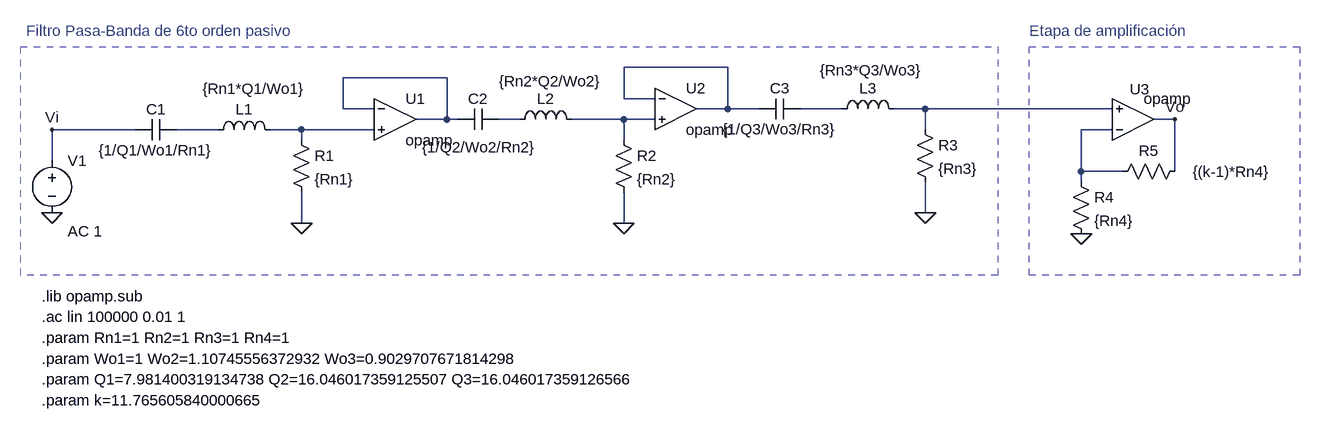
[diagram p0: schematic simulación circuital red pasiva 2.asc]
simulación circuital red pasiva 2.asc, the LTspice schematic file:
Version 4
SHEET 1 1604 680
WIRE 720 64 560 64
WIRE 288 80 128 80
WIRE 560 112 560 64
WIRE 608 112 560 112
WIRE 128 128 128 80
WIRE 176 128 128 128
WIRE 720 128 720 64
WIRE 720 128 672 128
WIRE 768 128 720 128
WIRE 896 128 832 128
WIRE 1024 128 976 128
WIRE 1312 128 1024 128
WIRE 288 144 288 80
WIRE 288 144 240 144
WIRE 304 144 288 144
WIRE 400 144 368 144
WIRE 560 144 480 144
WIRE 608 144 560 144
WIRE 1408 144 1376 144
WIRE -192 160 -320 160
WIRE -64 160 -128 160
WIRE 64 160 16 160
WIRE 176 160 64 160
WIRE 1024 160 1024 128
WIRE 1312 160 1264 160
WIRE 64 176 64 160
WIRE 560 176 560 144
WIRE -320 208 -320 160
WIRE 1264 224 1264 160
WIRE 1328 224 1264 224
WIRE 1408 224 1408 144
WIRE 1264 240 1264 224
WIRE 1024 288 1024 240
WIRE 64 304 64 256
WIRE 560 304 560 256
FLAG -320 288 0
FLAG 560 304 0
FLAG 1024 288 0
FLAG -320 160 Vi
FLAG 1264 320 0
FLAG 1408 144 Vo
FLAG 64 304 0
SYMBOL OpAmps\\opamp 208 80 R0
SYMATTR InstName U1
SYMBOL OpAmps\\opamp 640 64 R0
SYMATTR InstName U2
SYMBOL res 48 160 R0
SYMATTR InstName R1
SYMATTR Value {Rn1}
SYMBOL cap -128 144 R90
WINDOW 0 0 32 VBottom 2
WINDOW 3 32 32 VTop 2
SYMATTR InstName C1
SYMATTR Value {1/Q1/Wo1/Rn1}
SYMBOL ind -80 176 R270
WINDOW 0 32 56 VTop 2
WINDOW 3 95 71 VBottom 2
SYMATTR InstName L1
SYMATTR Value {Rn1*Q1/Wo1}
SYMBOL voltage -320 192 R0
WINDOW 123 24 124 Left 2
WINDOW 39 0 0 Left 0
SYMATTR Value2 AC 1
SYMATTR InstName V1
SYMATTR Value ""
SYMBOL res 544 160 R0
SYMATTR InstName R2
SYMATTR Value {Rn2}
SYMBOL cap 368 128 R90
WINDOW 0 0 32 VBottom 2
WINDOW 3 43 30 VTop 2
SYMATTR InstName C2
SYMATTR Value {1/Q2/Wo2/Rn2}
SYMBOL ind 384 160 R270
WINDOW 0 32 56 VTop 2
WINDOW 3 90 63 VBottom 2
SYMATTR InstName L2
SYMATTR Value {Rn2*Q2/Wo2}
SYMBOL res 1008 144 R0
SYMATTR InstName R3
SYMATTR Value {Rn3}
SYMBOL cap 832 112 R90
WINDOW 0 0 32 VBottom 2
WINDOW 3 32 32 VTop 2
SYMATTR InstName C3
SYMATTR Value {1/Q3/Wo3/Rn3}
SYMBOL ind 880 144 R270
WINDOW 0 32 56 VTop 2
WINDOW 3 91 61 VBottom 2
SYMATTR InstName L3
SYMATTR Value {Rn3*Q3/Wo3}
SYMBOL OpAmps\\opamp 1344 208 M180
WINDOW 0 -5 110 Left 2
SYMATTR InstName U3
SYMBOL res 1248 224 R0
SYMATTR InstName R4
SYMATTR Value {Rn4}
SYMBOL res 1424 208 R90
WINDOW 0 0 56 VBottom 2
WINDOW 3 1 -72 VTop 2
SYMATTR InstName R5
SYMATTR Value {(k-1)*Rn4}
TEXT -336 416 Left 2 !.lib opamp.sub
TEXT -336 448 Left 2 !.ac lin 100000 0.01 1
TEXT -336 480 Left 2 !.param Rn1=1 Rn2=1 Rn3=1 Rn4=1
TEXT -336 512 Left 2 !.param Wo1=1 Wo2=1.10745556372932 Wo3=0.9029707671814298
TEXT -336 544 Left 2 !.param Q1=7.981400319134738 Q2=16.046017359125507 Q3=16.046017359126566
TEXT -336 576 Left 2 !.param k=11.765605840000665
TEXT -360 8 Left 2 ;Filtro Pasa-Banda de 6to orden pasivo
TEXT 1184 8 Left 2 ;Etapa de amplificación
RECTANGLE Normal 1136 384 -368 32 2
RECTANGLE Normal 1600 384 1184 32 2

The netlist it stands for:
* simulación circuital red pasiva 2.asc
XU1 N002 N008 N002 opamp Aol=100K GBW=10Meg  ; pins invin noninvin out
XU2 N001 N006 N001 opamp Aol=100K GBW=10Meg  ; pins invin noninvin out
R1 N008 0 {Rn1}
C1 N007 Vi {1/Q1/Wo1/Rn1}
L1 N007 N008 {Rn1*Q1/Wo1}
V1 Vi 0 AC 1
R2 N006 0 {Rn2}
C2 N005 N002 {1/Q2/Wo2/Rn2}
L2 N005 N006 {Rn2*Q2/Wo2}
R3 N004 0 {Rn3}
C3 N003 N001 {1/Q3/Wo3/Rn3}
L3 N003 N004 {Rn3*Q3/Wo3}
XU3 N009 N004 Vo opamp Aol=100K GBW=10Meg  ; pins invin noninvin out
R4 N009 0 {Rn4}
R5 Vo N009 {(k-1)*Rn4}
.lib opamp.sub
.ac lin 100000 0.01 1
.param Rn1=1 Rn2=1 Rn3=1 Rn4=1
.param Wo1=1 Wo2=1.10745556372932 Wo3=0.9029707671814298
.param Q1=7.981400319134738 Q2=16.046017359125507 Q3=16.046017359126566
.param k=11.765605840000665
* Filtro Pasa-Banda de 6to orden pasivo
* Etapa de amplificación
.backanno
.end